# Altium project environmental-sensor.PrjPcb
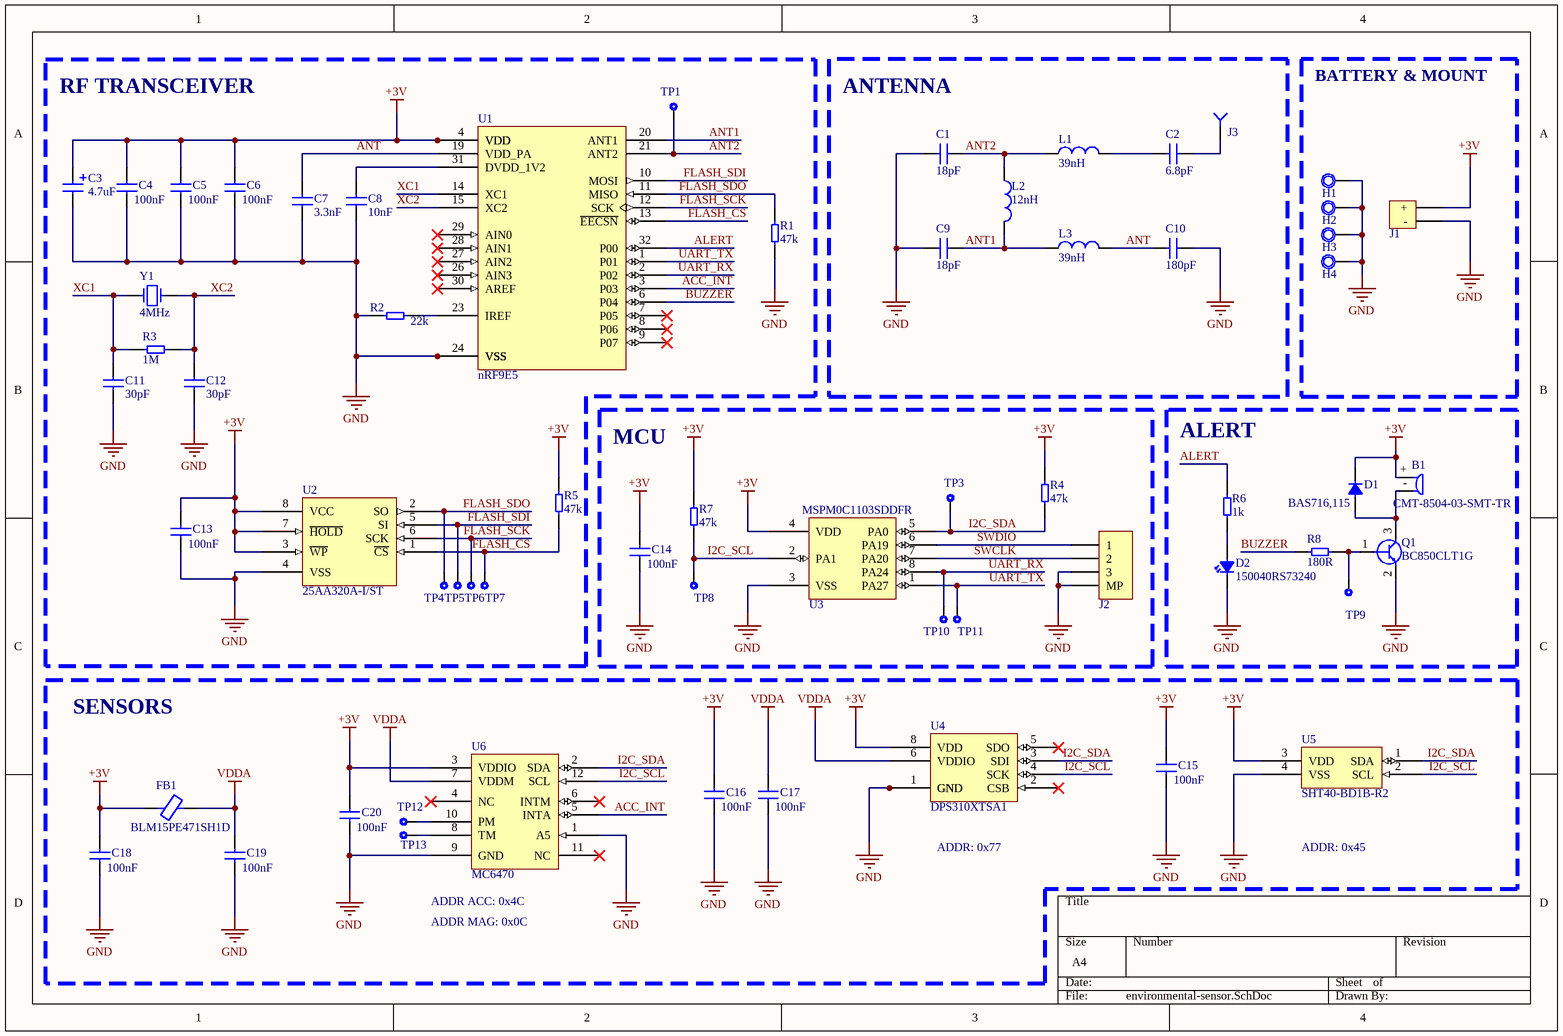
[diagram p0: environmental-sensor.SchDoc]
1 sheet, 62 parts. Net scope: global (net labels, ports and power ports of the same name join across sheets).
Board file: PCB.PcbDoc

## Sheet environmental-sensor.SchDoc
size A4; SheetNumber: 1; SheetTotal: 1

### Parts
B1  CMT-8504-03-SMT-TR  [CMT-8504-03-SMT-TR]
C1  value 18pF  [C_0402]  (hidden comment: GRM1555C2A180FA01D)
C2  value 6.8pF  [C_0402]  (hidden comment: GRM1555C2A6R8DA01D)
C3  value 4.7uF  [C_0805_Polarized]  (hidden comment: TMCP0J475MTRF)
C4  Capacitance: 100nF  [C_0402]  (hidden comment: GRM155R61A104KA01J)
C5  Capacitance: 100nF  [C_0402]  (hidden comment: GRM155R61A104KA01J)
C6  Capacitance: 100nF  [C_0402]  (hidden comment: GRM155R61A104KA01J)
C7  value 3.3nF  [C_0402]  (hidden comment: GRM1557U1A332JA01D)
C8  value 10nF  [C_0402]  (hidden comment: GRM155R70J103KA01D)
C9  value 18pF  [C_0402]  (hidden comment: GRM1555C2A180FA01D)
C10  value 180pF  [C_0402]  (hidden comment: GRM1555C1H181JA01J)
C11  value 30pF  [C_0402]  (hidden comment: GRM1555C1E300GA01D)
C12  value 30pF  [C_0402]  (hidden comment: GRM1555C1E300GA01D)
C13  Capacitance: 100nF  [C_0402]  (hidden comment: GRM155R61A104KA01J)
C14  Capacitance: 100nF  [C_0402]  (hidden comment: GRM155R61A104KA01J)
C15  Capacitance: 100nF  [C_0402]  (hidden comment: GRM155R61A104KA01J)
C16  Capacitance: 100nF  [C_0402]  (hidden comment: GRM155R61A104KA01J)
C17  Capacitance: 100nF  [C_0402]  (hidden comment: GRM155R61A104KA01J)
C18  Capacitance: 100nF  [C_0402]  (hidden comment: GRM155R61A104KA01J)
C19  Capacitance: 100nF  [C_0402]  (hidden comment: GRM155R61A104KA01J)
C20  Capacitance: 100nF  [C_0402]  (hidden comment: GRM155R61A104KA01J)
D1  BAS716,115  [SOD523]
D2  150040RS73240  [LED_0402]
FB1  BLM15PE471SH1D  [L_0402]
H1  Mounting_Hole_M2  [M2]  (value not drawn)
H2  Mounting_Hole_M2  [M2]  (value not drawn)
H3  Mounting_Hole_M2  [M2]  (value not drawn)
H4  Mounting_Hole_M2  [M2]  (value not drawn)
J1  SMTU2032-LF.TR  [SMTU2032-LF.TR]  (value not drawn)
J2  BM03B-SRSS-TB(LF)(SN)  [BM03B-SRSS-TBT(LF)(SN)]  (value not drawn)
J3  Antenna  [Antenna_1mm]  (value not drawn)
L1  value 39nH  [L_0402]  (hidden comment: MCLA1005V2-390-R)
L2  value 12nH  [L_0402]  (hidden comment: PE-0402CL120JTT)
L3  value 39nH  [L_0402]  (hidden comment: MCLA1005V2-390-R)
Q1  BC850CLT1G  [SOT23-3]
R1  value 47k  [R_0402]  (hidden comment: CR0402-FX-4702GLF)
R2  value 22k  [R_0402]  (hidden comment: CR0402-FX-2202GLF)
R3  value 1M  [R_0402]  (hidden comment: CR0402-FX-1004GLF)
R4  value 47k  [R_0402]  (hidden comment: CR0402-FX-4702GLF)
R5  value 47k  [R_0402]  (hidden comment: CR0402-FX-4702GLF)
R6  value 1k  [R_0402]  (hidden comment: CR0402-FX-1001GLF)
R7  value 47k  [R_0402]  (hidden comment: CR0402-FX-4702GLF)
R8  value 180R  [R_0402]  (hidden comment: CR0402-FX-1800GLF)
TP1  TestPoint_0.5mm  [TestPoint_0.5mm]  (value not drawn)
TP3  TestPoint_1mm  [TestPoint_1mm]  (value not drawn)
TP4  TestPoint_1mm  [TestPoint_1mm]  (value not drawn)
TP5  TestPoint_1mm  [TestPoint_1mm]  (value not drawn)
TP6  TestPoint_1mm  [TestPoint_1mm]  (value not drawn)
TP7  TestPoint_1mm  [TestPoint_1mm]  (value not drawn)
TP8  TestPoint_1mm  [TestPoint_1mm]  (value not drawn)
TP9  TestPoint_1mm  [TestPoint_1mm]  (value not drawn)
TP10  TestPoint_1mm  [TestPoint_1mm]  (value not drawn)
TP11  TestPoint_1mm  [TestPoint_1mm]  (value not drawn)
TP12  TestPoint_1mm  [TestPoint_1mm]  (value not drawn)
TP13  TestPoint_1mm  [TestPoint_1mm]  (value not drawn)
U1  nRF9E5  [QFN32L]
U2  25AA320A-I/ST  [TSSOP8]
U3  MSPM0C1103SDDFR  [SOT-23_8]
U4  DPS310XTSA1  [LGA-8L]
U5  SHT40-BD1B-R2  [DFN-SHT4]
U6  MC6470  [QFN12]
Y1  value 4MHz  [Crystal_11.7x5.0]  (hidden comment: FOXSDLF/040)

### Blocks framed on the sheet
RF TRANSCEIVER: C3-C8 C11-C13 R1-R3 R5 TP1 TP4-TP7 U1 U2 Y1
ANTENNA: C1 C2 C9 C10 J3 L1-L3
BATTERY & MOUNT: H1-H4 J1
MCU: C14 J2 R4 R7 TP3 TP8 TP10 TP11 U3
ALERT: B1 D1 D2 Q1 R6 R8 TP9

### Nets
+3V: B1.+ C3.1 C4.2 C5.2 C6.2 C13.2 C14.2 C15.2 C16.2 C18.2 C20.2 D1.1 FB1.1 J1.0(+) R4.2 R5.2 R7.2 U1.4(VDD) U1.17(VDD) U1.25(VDD) U2.3(~{WP}) U2.7(~{HOLD}) U2.8(VCC) U3.4(VDD) U4.8(VDD) U5.3(VDD) U6.3(VDDIO)
GND: C1.1 C3.2 C4.1 C5.1 C6.1 C7.1 C8.1 C9.1 C10.2 C11.1 C12.1 C13.1 C14.1 C15.1 C16.1 C17.1 C18.1 C19.1 C20.1 D2.1 H1.1 H2.1 H3.1 H4.1 J1.1(-) J2.0(MP) J2.3 Q1.2 R1.1 R2.1 U1.5(VSS) U1.16(VSS) U1.18(VSS) U1.22(VSS) U1.24(VSS) U2.4(VSS) U3.3(VSS) U4.1(GND) U4.7(GND) U5.4(VSS) U6.1(A5) U6.9(GND)
VDDA: C17.2 C19.2 FB1.2 U4.6(VDDIO) U6.7(VDDM)
ACC_INT: U1.3(P03) U6.5(INTA)
ALERT: R6.2 U1.32(P00)
ANT: C7.2 C10.1 L3.1 U1.19(VDD_PA)
ANT1: C9.2 L2.1 L3.2 U1.20(ANT1)
ANT2: C1.2 L1.2 L2.2 TP1.1 U1.21(ANT2)
BUZZER: R8.1 U1.6(P04)
FLASH~{_CS}: R5.1 TP7.1 U1.13(~{EECSN}) U2.1(~{CS})
FLASH_SCK: TP6.1 U1.12(SCK) U2.6(SCK)
FLASH_SDI: TP5.1 U1.10(MOSI) U2.5(SI)
FLASH_SDO: R1.2 TP4.1 U1.11(MISO) U2.2(SO)
I2C_SCL: R7.1 TP8.1 U3.2(PA1) U4.4(SCK) U5.2(SCL) U6.12(SCL)
I2C_SDA: R4.1 TP3.1 U3.5(PA0) U4.3(SDI) U5.1(SDA) U6.2(SDA)
SWCLK: J2.2 U3.7(PA20)
SWDIO: J2.1 U3.6(PA19)
UART_RX: TP10.1 U1.2(P02) U3.8(PA24)
UART_TX: TP11.1 U1.1(P01) U3.1(PA27)
XC1: C11.2 R3.1 U1.14(XC1) Y1.1
XC2: C12.2 R3.2 U1.15(XC2) Y1.2
NetB1_-: B1.- Q1.3
NetC2_1: C2.1 L1.1
NetC2_2: C2.2 J3.1
NetC8_2: C8.2 U1.31(DVDD_1V2)
NetD2_2: D2.2 R6.1
NetQ1_1: Q1.1 R8.2 TP9.1
NetR2_2: R2.2 U1.23(IREF)
NetTP12_1: TP12.1 U6.10(PM)
NetTP13_1: TP13.1 U6.8(TM)

Not connected (* = marked no-connect by the designer): D1 2; U1 7(P05)* 8(P06)* 9(P07)* 26(AIN3)* 27(AIN2)* 28(AIN1)* 29(AIN0)* 30(AREF)*; U4 2(CSB)* 5(SDO)*; U6 4(NC)* 6(INTM)* 11(NC)*

### Notes on the sheet
- SENSORS
- ADDR: 0x77
- ADDR: 0x45
- (near U6) ADDR ACC: 0x4C
- ADDR MAG: 0x0C

### Library data of the parts
B1 = CMT-8504-03-SMT-TR: Piezo Buzzers & Audio Indicators 8.5mmx4mm 3 V, 85 dB, Surface Mount, Transducer; Supplier 1: Digikey; Supplier Part Number 1: 2223-CMT-8504-03-SMT-TRCT-ND
C1 C9 = GRM1555C2A180FA01D: Multilayer Ceramic Capacitors MLCC - SMD/SMT 18 pF 100 VDC 1% 0402 C0G (NP0); Voltage: 100V; Supplier 1: Mouser; Supplier Part Number 1: 81-GRM1555C2A180FA1D; Tolerance: 1%
C2 = GRM1555C2A6R8DA01D: Multilayer Ceramic Capacitors MLCC - SMD/SMT 6.8 pF 100 VDC 0.5 pF 0402 C0G (NP0); Voltage: 100V; Supplier 1: Mouser; Supplier Part Number 1: 81-GRM1555C2A6R8DA1D
C3 = TMCP0J475MTRF: Tantalum Capacitors - Solid SMD 7volts 4.7uF 20% Molded Case, 0805; Voltage: 6.3V; Supplier 1: Mouser; Supplier Part Number 1: 74-TMCP0J475MTRF; Tolerance: 20%
C4-C6 C13-C20 = GRM155R61A104KA01J: Multilayer Ceramic Capacitors MLCC - SMD/SMT 0.1 uF 10 VDC 10% 0402 X5R; Voltage: 10V; Supplier 1: Mouser; Supplier Part Number 1: 81-GRM15R61A104KA01J; Tolerance: 10%
C7 = GRM1557U1A332JA01D: Multilayer Ceramic Capacitors MLCC - SMD/SMT 3300 pF 10 VDC 5% 0402 U2J; Voltage: 10V; Supplier 1: Mouser; Supplier Part Number 1: 81-GRM1557U1A332JA1D; Tolerance: 5%
C8 = GRM155R70J103KA01D: Multilayer Ceramic Capacitors MLCC - SMD/SMT 0.01 uF 6.3 VDC 10% 0402 X7R; Voltage: 6.3V; Supplier 1: Mouser; Supplier Part Number 1: 81-GRM155R70J103KA1D; Tolerance: 10%
C10 = GRM1555C1H181JA01J: Multilayer Ceramic Capacitors MLCC - SMD/SMT 180 pF 50 VDC 5% 0402 C0G (NP0); Voltage: 50V; Supplier 1: Mouser; Supplier Part Number 1: 81-GRM1555C1H181JA1J; Tolerance: 5%
C11 C12 = GRM1555C1E300GA01D: Multilayer Ceramic Capacitors MLCC - SMD/SMT 30 pF 25 VDC 2% 0402 C0G (NP0); Voltage: 25V; Supplier 1: Mouser; Supplier Part Number 1: 81-GRM1555C1E300GA1D; Tolerance: 2%
D1 = BAS716,115: Rectifiers BAS716/SOD523/SC-79; Vf: 0.92V; VRRM: 75V; If: 200mA; Supplier 1: Rs; Supplier Part Number 1: 1661367
D2 = 150040RS73240: Single Colour LEDs WL-SMCC SMD MonoChip LED 0402 Red 630nm; Supplier 1: Rs; Supplier Part Number 1: 1766150; Value: RED
FB1 = BLM15PE471SH1D: Ferrite Beads 470 OHM 25%; Value: 470R; IDC: 750mA; RDC: 370mR; Supplier 1: Mouser; Supplier Part Number 1: 81-BLM15PE471SH1D; Tolerance: 25%
J1 = SMTU2032-LF.TR: Coin Cell Battery Holders SFC MNT FOR CR2032 485PCS/REEL; pin to pad: 0>1 1>2; Supplier 1: Mouser; Supplier Part Number 1: 614-SMTU2032-LF.TR
J2 = BM03B-SRSS-TB(LF)(SN): Złącze: przewód-płytka; gniazdo; męskie; SH,SR; 1mm; PIN: 3; SMT; 50V; Supplier 1: Arrow Electronics; Supplier Part Number 1: BM03B-SRSS-TBT(LF)(SN)
L1 L3 = MCLA1005V2-390-R: RF Inductors - SMD MCLA Auto Chip IND 1005 39nH 2 Pads; Q: 8; RDC: 1R; IDC: 200mA; SRF: 1200MHz; Supplier 1: Mouser; Supplier Part Number 1: 504-MCLA1005V2-390-R
L2 = PE-0402CL120JTT: RF Inductors - SMD 0402 12nH 300mA DCR=500mOhms RF; pin to pad: 0>1; RDC: 0.5R; SRF: 2700MHz; Q: 8; Supplier 1: Digikey; Supplier Part Number 1: 553-PE-0402CL120JTTCT-ND; IDC: 300mA
Q1 = BC850CLT1G: Bipolar Transistors - BJT 100mA 50V NPN; Supplier 1: Rs; Supplier Part Number 1: 464259
R1 R4 R5 R7 = CR0402-FX-4702GLF: Thick Film Resistors - SMD 47K OHM 1%; Power: 62.5mW; Voltage: 50V; Supplier 1: Rs; Supplier Part Number 1: 2477012; Tolerance: 1%
R2 = CR0402-FX-2202GLF: Thick Film Resistors - SMD 22K OHM 1%; Power: 62.5mW; Voltage: 50V; Supplier 1: Rs; Supplier Part Number 1: 2477003; Tolerance: 1%
R3 = CR0402-FX-1004GLF: Thick Film Resistors - SMD 1.0M OHM 1%; Power: 62.5mW; Supplier 1: Rs; Supplier Part Number 1: 2476986; Tolerance: 1%
R6 = CR0402-FX-1001GLF: Thick Film Resistors - SMD 1.0K OHM 1%; Power: 62.5mW; Supplier 1: Rs; Supplier Part Number 1: 2231667; Tolerance: 1%
R8 = CR0402-FX-1800GLF: Thick Film Resistors - SMD 180 OHM 1%; Power: 62.5mW; Supplier 1: Digikey; Supplier Part Number 1: CR0402-FX-1800GLFCT-ND; Tolerance: 1%
U1 = nRF905: RF Transceiver 1.9-3.6V 433/868/ 915MHz TRNSCVR; Supplier 1: RS; Supplier Part Number 1: 8855794
U2 = 25AA320A-I/ST: EEPROM 32K 4KX8 1.8V SER EE IND; Supplier 1: Digikey; Supplier Part Number 1: 25AA320AXT-I/STTR-ND
U3 = MSPM0C1103SDDFR: ARM Microcontrollers - MCU 24MHz Arm Cortex-M0+ MCU with 8KB flash; Supplier 1: Mouser; Supplier Part Number 1: 595-MSPM0C1103SDDFR; Flash: 8kB
U4 = DPS310XTSA1: Board Mount Pressure Sensors PRESSURE SENSOR & Temperature sensor; Supplier 1: Mouser; Supplier Part Number 1: 726-DPS310XTSA1
U5 = SHT40-BD1B-R2: Board Mount Humidity Sensors +/-1.8%RH/+/-0.2C, 4th generation, digital (I2C) humidity and temperature sensor with 0x45 I2C address.; Supplier 1: Digikey; Supplier Part Number 1: 1649-SHT40-BD1B-R2CT-ND
U6 = MC6470: IMUs - Inertial Measurement Units 8g, 14-Bit Output 6-Axis eCompass; Supplier 1: Digikey; Supplier Part Number 1: 2548-MC6470CT-ND
Y1 = FOXSDLF/040: Crystals 4MHz 20pF; Tolerance: 50ppm; Supplier 1: Farnell; Supplier Part Number 1: 2063966RL; Load Capacitance: 20pF